# EAGLE design Board 1 (EAGLE 8.4.1)
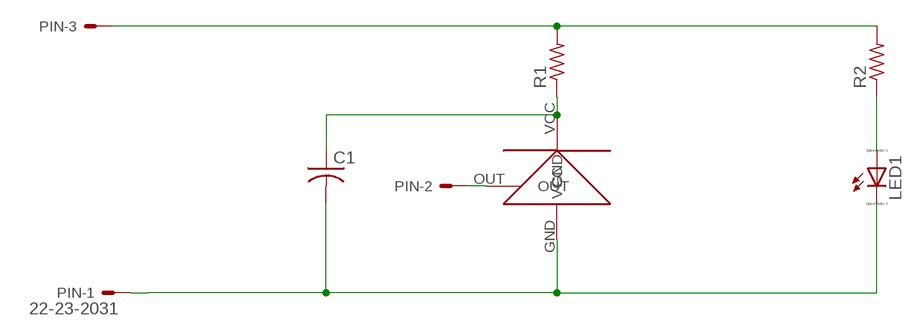
[diagram p0: schematic, sheet 1]

## Parts
C1  C-USC0805  [C0805]
LED1  LED_ELD260  [LED_LD260]
PIN  22-23-2031  [22-23-2031]
R1  R-US_R0805  [R0805]
R2  R-US_R0805  [R0805]
U$1  TSOP38238  [TSOP38238]

## Nets
GND: C1.2 LED1.K(C) PIN.1 U$1.GND
N$1: LED1.A R2.1
N$3: C1.1 R1.1 U$1.VCC
OUT: PIN.2 U$1.OUT
VCC: PIN.3 R1.2 R2.2

## Library data of the parts
C1 = rcl:C-US: CAPACITOR, American symbol
LED1 = eagle-ltspice:LED_E: LED Source: http://www.osram.convergy.de Source: www.luxeon.com Source: www.kingbright.com; SPICEMODEL: NONE; SPICEPREFIX: D; SPICETYPE: diode
PIN = con-molex:22-23-2031: .100" (2.54mm) Center Header - 3 Pin; MF: MOLEX; MPN: 22-23-2031; OC_FARNELL: 1462950; OC_NEWARK: 30C0862
R1 R2 = resistor:R-US_: RESISTOR, American symbol
U$1 = Intro Project:TSOP38238

## Board
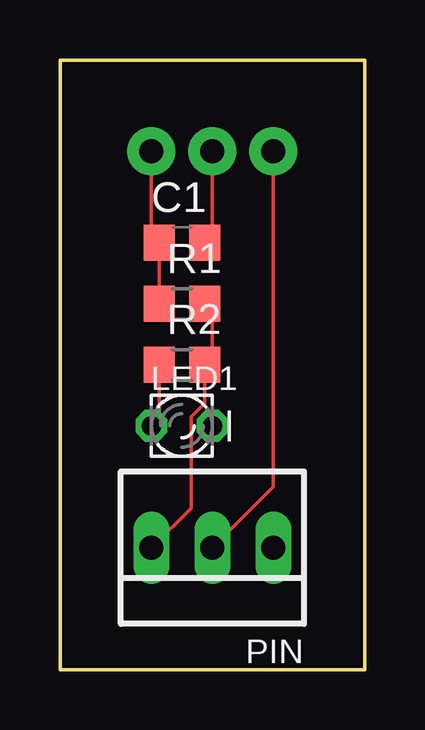
[diagram p1: board, top side]
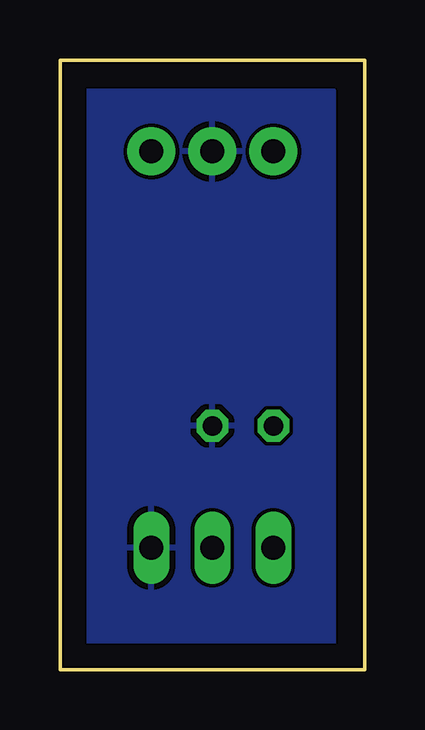
[diagram p2: board, bottom side, seen from below]

Size 12.7 x 25.4 mm. Coordinates in mm from the lower left corner, seen from the top.
Outline: 0,25.4 12.7,25.4 12.7,0 0,0 0,25.4
Copper layers (1*16): Top 0.035mm / dielectric 1.5mm / Bottom 0.035mm
Design rules "default": minimum track width 6mil, minimum drill 0.35mm, track to track 6mil, track to pad 6mil, pad to pad 6mil, via to via 6mil, smd to smd 6mil, copper to edge 40mil, drill to drill 6mil, minimum pad ring 10mil, minimum via ring 8mil, stop-mask expansion 4mil, vias tented up to drill 0mil, thermal gap 10mil

### Footprints (pad centres in the part's own frame; a part is rotated, then mirrored left to right if it is on the bottom)
C0805 = smd 1.3 x 1.5: 1 -0.95,0; 2 0.95,0
LED_LD260 = drill 0.813 octagon: A -1.27,0; K 1.27,0
22-23-2031 = drill 1 long: 1 -2.54,0; 2 0,0; 3 2.54,0
R0805 = smd 1.3 x 1.5: 1 -0.95,0; 2 0.95,0
TSOP38238 = drill 1 pad 2: GND 0,0; OUT -2.54,0; VCC 2.54,0

### Placement (x,y rotation side)
C1  5.08,17.78 0 top
LED1  5.08,10.16 0 top
PIN  6.35,5.08 180 top
R1  5.08,15.24 0 top
R2  5.08,12.7 0 top
U$1  6.35,21.59 180 top

### Tracks (layer width: path | path; a pad name or v marks a point on that pad's centre or on a via)
GND
  Top 0.152: U$1.GND 6.35,17.78 C1.2
  pour Bottom: 1.27,24.13 1.27,-5.08 33.02,-5.08 33.02,24.13
N$1
  Top 0.152: R2.1 4.13,10.48 LED1.A
N$3
  Top 0.152: 4.13,21.27 U$1.VCC 3.81,18.1 C1.1 R1.1
OUT
  Top 0.152: U$1.OUT 8.89,7.62 PIN.2
VCC
  Top 0.152: R1.2 6.35,14.92 6.35,12.7 R2.2 6.03,11.1 5.46,10.53 5.46,6.73 PIN.3